# Altium schematic sheet SCA-Analog.SchDoc: SCA Analog
size A; DocumentNumber: 21; SheetNumber: 21; SheetTotal: 22
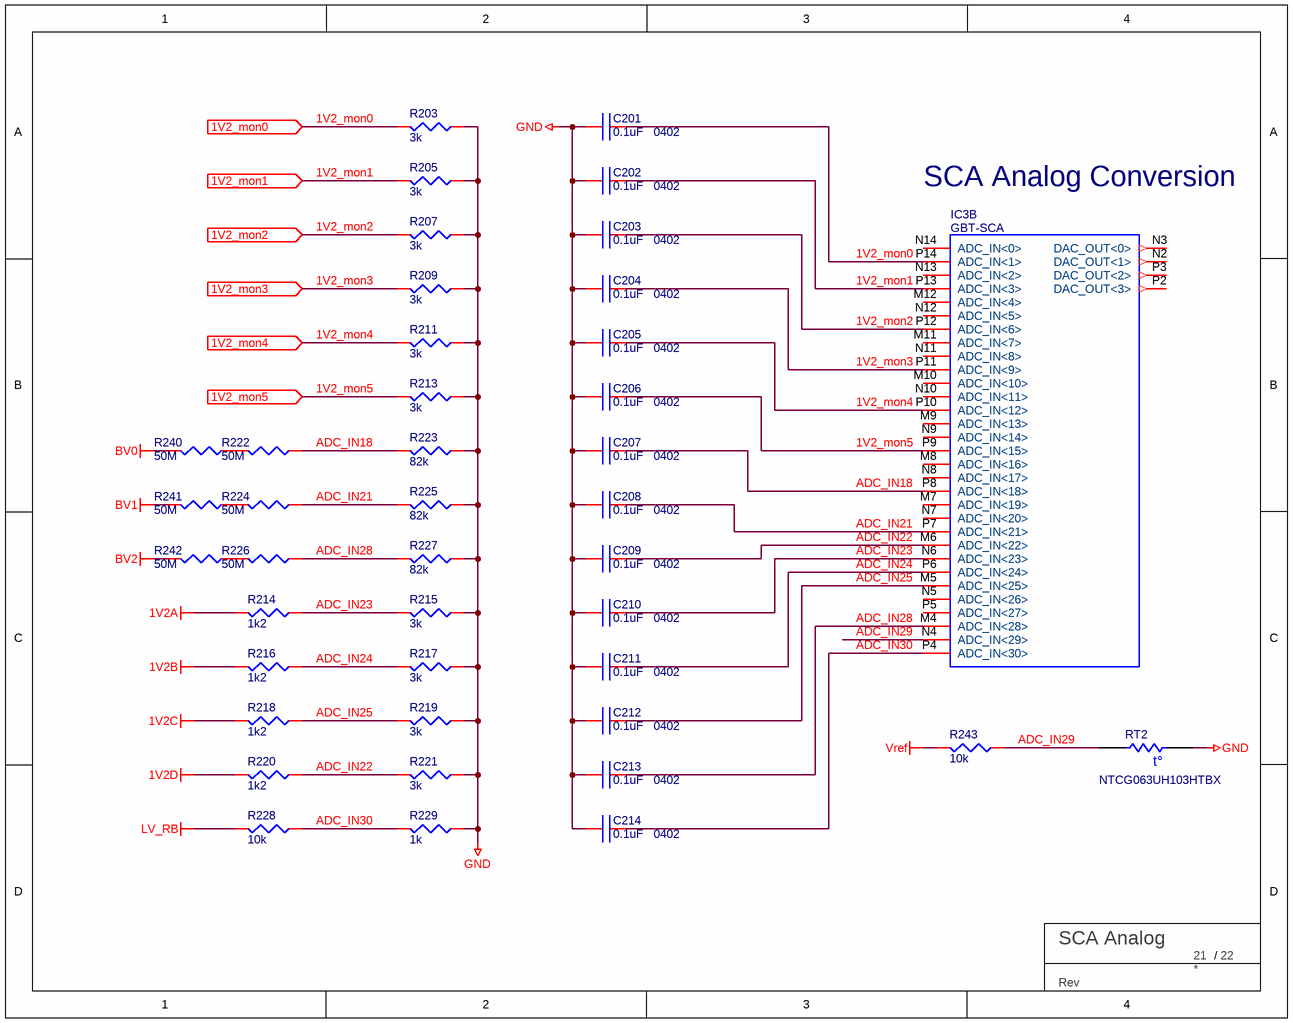
[diagram p0: SCA-Analog.SchDoc]

## Parts
C201  0.1uF  Package: 0402  [C_0402_IPC_NOSILK]
C202  0.1uF  Package: 0402  [C_0402_IPC_NOSILK]
C203  0.1uF  Package: 0402  [C_0402_IPC_NOSILK]
C204  0.1uF  Package: 0402  [C_0402_IPC_NOSILK]
C205  0.1uF  Package: 0402  [C_0402_IPC_NOSILK]
C206  0.1uF  Package: 0402  [C_0402_IPC_NOSILK]
C207  0.1uF  Package: 0402  [C_0402_IPC_NOSILK]
C208  0.1uF  Package: 0402  [C_0402_IPC_NOSILK]
C209  0.1uF  Package: 0402  [C_0402_IPC_NOSILK]
C210  0.1uF  Package: 0402  [C_0402_IPC_NOSILK]
C211  0.1uF  Package: 0402  [C_0402_IPC_NOSILK]
C212  0.1uF  Package: 0402  [C_0402_IPC_NOSILK]
C213  0.1uF  Package: 0402  [C_0402_IPC_NOSILK]
C214  0.1uF  Package: 0402  [C_0402_IPC_NOSILK]
IC3  GBT-SCA  [BGA196C80P14X14_1200X1200X170]  (part B of 6)
R203  3k  [R_0402_IPC]
R205  3k  [R_0402_IPC]
R207  3k  [R_0402_IPC]
R209  3k  [R_0402_IPC]
R211  3k  [R_0402_IPC]
R213  3k  [R_0402_IPC]
R214  1k2  [R_0402_IPC]
R215  3k  [R_0402_IPC]
R216  1k2  [R_0402_IPC]
R217  3k  [R_0402_IPC]
R218  1k2  [R_0402_IPC]
R219  3k  [R_0402_IPC]
R220  1k2  [R_0402_IPC]
R221  3k  [R_0402_IPC]
R222  50M  [RESC3216N]
R223  82k  [R_0402_IPC]
R224  50M  [RESC3216N]
R225  82k  [R_0402_IPC]
R226  50M  [RESC3216N]
R227  82k  [R_0402_IPC]
R228  10k  [R_0402_IPC]
R229  1k  [R_0402_IPC]
R240  50M  [RESC3216N]
R241  50M  [RESC3216N]
R242  50M  [RESC3216N]
R243  10k  [R_0402_IPC]
RT2  NTCG063UH103HTBX  [resc0603]
TBLOCK?  BU Title block  (value not drawn)  (graphical)

## Ports
1V2_mon0 (in), 1V2_mon1 (in), 1V2_mon2 (in), 1V2_mon3 (in), 1V2_mon4 (in), 1V2_mon5 (in)

## Nets
1V2A: R214.2
1V2B: R216.2
1V2C: R218.2
1V2D: R220.2
BV0: R240.2
BV1: R241.2
BV2: R242.2
GND: C201.1 C202.1 C203.1 C204.1 C205.1 C206.1 C207.1 C208.1 C209.1 C210.1 C211.1 C212.1 C213.1 C214.1 R203.1 R205.1 R207.1 R209.1 R211.1 R213.1 R215.1 R217.1 R219.1 R221.1 R223.1 R225.1 R227.1 R229.1 RT2.1
LV_RB: R228.2
Vref: R243.2
1V2_mon0: C201.2 IC3.P14(ADC_IN<1>) R203.2 ; port 1V2_mon0
1V2_mon1: C202.2 IC3.P13(ADC_IN<3>) R205.2 ; port 1V2_mon1
1V2_mon2: C203.2 IC3.P12(ADC_IN<6>) R207.2 ; port 1V2_mon2
1V2_mon3: C204.2 IC3.P11(ADC_IN<9>) R209.2 ; port 1V2_mon3
1V2_mon4: C205.2 IC3.P10(ADC_IN<12>) R211.2 ; port 1V2_mon4
1V2_mon5: C206.2 IC3.P9(ADC_IN<15>) R213.2 ; port 1V2_mon5
ADC_IN18: C207.2 IC3.P8(ADC_IN<18>) R222.1 R223.2
ADC_IN21: C208.2 IC3.P7(ADC_IN<21>) R224.1 R225.2
ADC_IN22: C209.2 IC3.M6(ADC_IN<22>) R220.1 R221.2
ADC_IN23: C210.2 IC3.N6(ADC_IN<23>) R214.1 R215.2
ADC_IN24: C211.2 IC3.P6(ADC_IN<24>) R216.1 R217.2
ADC_IN25: C212.2 IC3.M5(ADC_IN<25>) R218.1 R219.2
ADC_IN28: C213.2 IC3.M4(ADC_IN<28>) R226.1 R227.2
ADC_IN29: IC3.N4(ADC_IN<29>) R243.1 RT2.2
ADC_IN30: C214.2 IC3.P4(ADC_IN<30>) R228.1 R229.2
NetR222_2: R222.2 R240.1
NetR224_2: R224.2 R241.1
NetR226_2: R226.2 R242.1

Not connected (* = marked no-connect by the designer): IC3 M7(ADC_IN<19>) M8(ADC_IN<16>) M9(ADC_IN<13>) M10(ADC_IN<10>) M11(ADC_IN<7>) M12(ADC_IN<4>) N2(DAC_OUT<1>) N3(DAC_OUT<0>) N5(ADC_IN<26>) N7(ADC_IN<20>) N8(ADC_IN<17>) N9(ADC_IN<14>) N10(ADC_IN<11>) N11(ADC_IN<8>) N12(ADC_IN<5>) N13(ADC_IN<2>) N14(ADC_IN<0>) P2(DAC_OUT<3>) P3(DAC_OUT<2>) P5(ADC_IN<27>)

## Notes on the sheet
- SCA Analog Conversion
- (in symbol Res Thermal) t°
- (in symbol TITLE_BLOCK_BU) /; Rev

## Library data of the parts
C201-C214 = C-CER-E5-0.1uF-0402-25V-X7R: GRM155R71E104ME14D; Voltage: 25V; TempCo: X7R
IC3 = CERN_GBT-SCA_REV 6.2: The Slow Control Adapter ASIC for the GBT System; Device: GBT-SCA
R203 R205 R207 R209 R211 R213 R215 R217 R219 R221 = R-E3-3K0-0402-0.5%: RES SMD 3.0K OHM 0.5% 1/16W 0402; Part Number: RR0510P-302-D
R214 R216 R218 R220 = R-E3-1K2-0402-0.5%: RES SMD 1.2K OHM 0.5% 1/16W 0402; Part Number: RR0510P-122-D
R222 R224 R226 R240-R242 = R-E6-50M-1206: HVC1206T5005JET
R223 R225 R227 = R-E4-82k0-0402-0.5%: RES SMD 82k OHM 0.5% 1/16W 0402; Part Number: RR0510P-823-D
R228 R243 = R-E4-10k-0402-0.5%: RES SMD 1.2K OHM 0.5% 1/16W 0402; Part Number: RR0510P-103-D
R229 = R-E3-1K0-0402-0.5%: RES SMD 1K OHM 0.5% 1/16W 0402; Part Number: RR0510P-102-D
RT2 = Res Thermal: Thermistor; Published: 24-Mar-1999; LatestRevisionDate: 29-May-2009; LatestRevisionNote: IPC-7351 Footprint Added.; PackageVersion: Mar-2003; PackageReference: 6-0805; Publisher: Altium Limited; PackageDescription: Chip Resistor 0805 Case Size; Code_IPC: RESC2012
TBLOCK? = TITLE_BLOCK_BU